# EAGLE design xplorer (EAGLE 6.3)

## Sheet 1 of 5: RPI
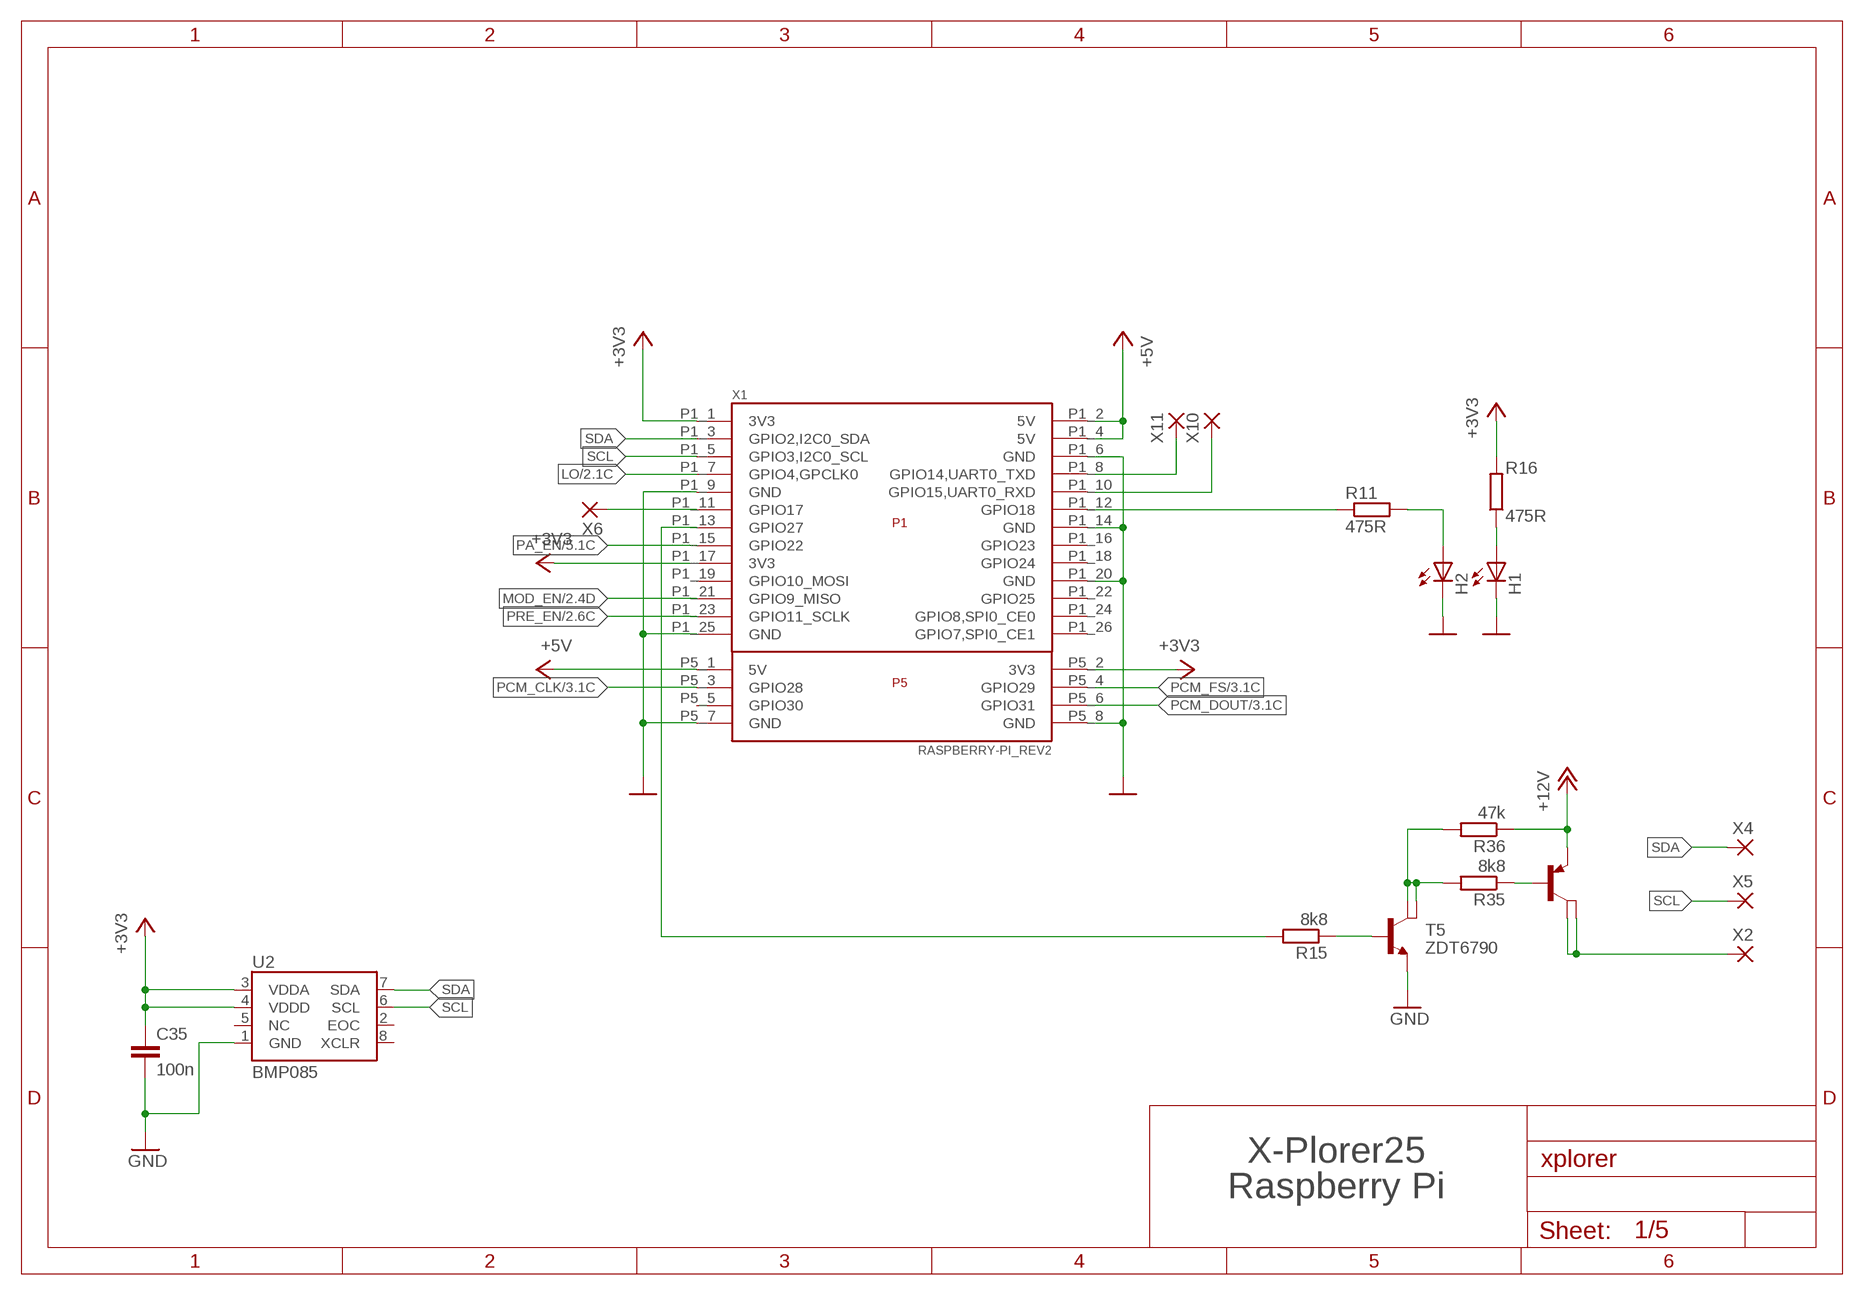
[diagram p0: schematic, sheet 1]

### Parts
C35  100n  C-0603  [0603]
H1  LEDCHIPLED_0603  [CHIPLED_0603]
H2  LEDCHIPLED_0603  [CHIPLED_0603]
R11  475R  R-EU_R0402  [R0402]
R15  8k8  R-EU_R0603  [R0603]
R16  475R  R-EU_R0402  [R0402]
R35  8k8  R-EU_R0603  [R0603]
R36  47k  R-EU_R0603  [R0603]
T5  ZDT6790  [SOT223-8]
U2  BMP085  [BMP085]
X1  RASPBERRY-PI_REV2  [RASPBERRY-PI_REV2]
X2  SMD2  [SMD1,27-2,54]
X4  SMD2  [SMD1,27-2,54]
X5  SMD2  [SMD1,27-2,54]
X6  SMD2  [SMD1,27-2,54]
X10  SMD2  [SMD1,27-2,54]
X11  SMD2  [SMD1,27-2,54]

### Nets
$234567898765: T5.3(C1) T5.4(C2) X2.1(P)
+3V3: C35.1 R16.2 U2.3(VDDA) U2.4(VDDD) X1.P1_1(3V3) X1.P1_17(3V3) X1.P5_2(3V3)
+5V: X1.P1_2(5V) X1.P1_4(5V) X1.P5_1(5V) ; also sheet 2,3,5
+12V: R36.1 T5.5(E) ; also sheet 2,5
GND: C35.2 H1.C H2.C T5.7(E) U2.1(GND) X1.P1_6(GND) X1.P1_9(GND) X1.P1_14(GND) X1.P1_20(GND) X1.P1_25(GND) X1.P5_7(GND) X1.P5_8(GND) ; also sheet 2,3,5
LO: X1.P1_7(GPIO4,GPCLK0) ; also sheet 2
MOD_EN: X1.P1_21(GPIO9_MISO) ; also sheet 2
N$16: H2.A R11.2
N$18: H1.A R16.1
N$29: X1.P1_10(GPIO15,UART0_RXD) X10.1(P)
N$31: R11.1 X1.P1_12(GPIO18)
N$42: R15.1 T5.8(B)
N$54: R35.2 R36.2 T5.1(C1) T5.2(C2)
N$55: R35.1 T5.6(B)
N$57: X1.P1_8(GPIO14,UART0_TXD) X11.1(P)
N$66: R15.2 X1.P1_13(GPIO27)
PA_EN: X1.P1_15(GPIO22) ; also sheet 5
PCM_CLK: X1.P5_3(GPIO28) ; also sheet 3
PCM_DOUT: X1.P5_6(GPIO31) ; also sheet 3
PCM_FS: X1.P5_4(GPIO29) ; also sheet 3
PRE_EN: X1.P1_23(GPIO11_SCLK) ; also sheet 2
REL_FB: X1.P1_11(GPIO17) X6.1(P)
SCL: U2.6(SCL) X1.P1_5(GPIO3,I2C0_SCL) X5.1(P)
SDA: U2.7(SDA) X1.P1_3(GPIO2,I2C0_SDA) X4.1(P)
Unconnected: U2.2(EOC) U2.5(NC) U2.8(XCLR) X1.P1_16(GPIO23) X1.P1_18(GPIO24) X1.P1_19(GPIO10_MOSI) X1.P1_22(GPIO25) X1.P1_24(GPIO8,SPI0_CE0) X1.P1_26(GPIO7,SPI0_CE1) X1.P5_5(GPIO30)

### Notes on the sheet
- T5
- ZDT6790
- X-Plorer25
- Raspberry Pi

## Sheet 2 of 5: IQ
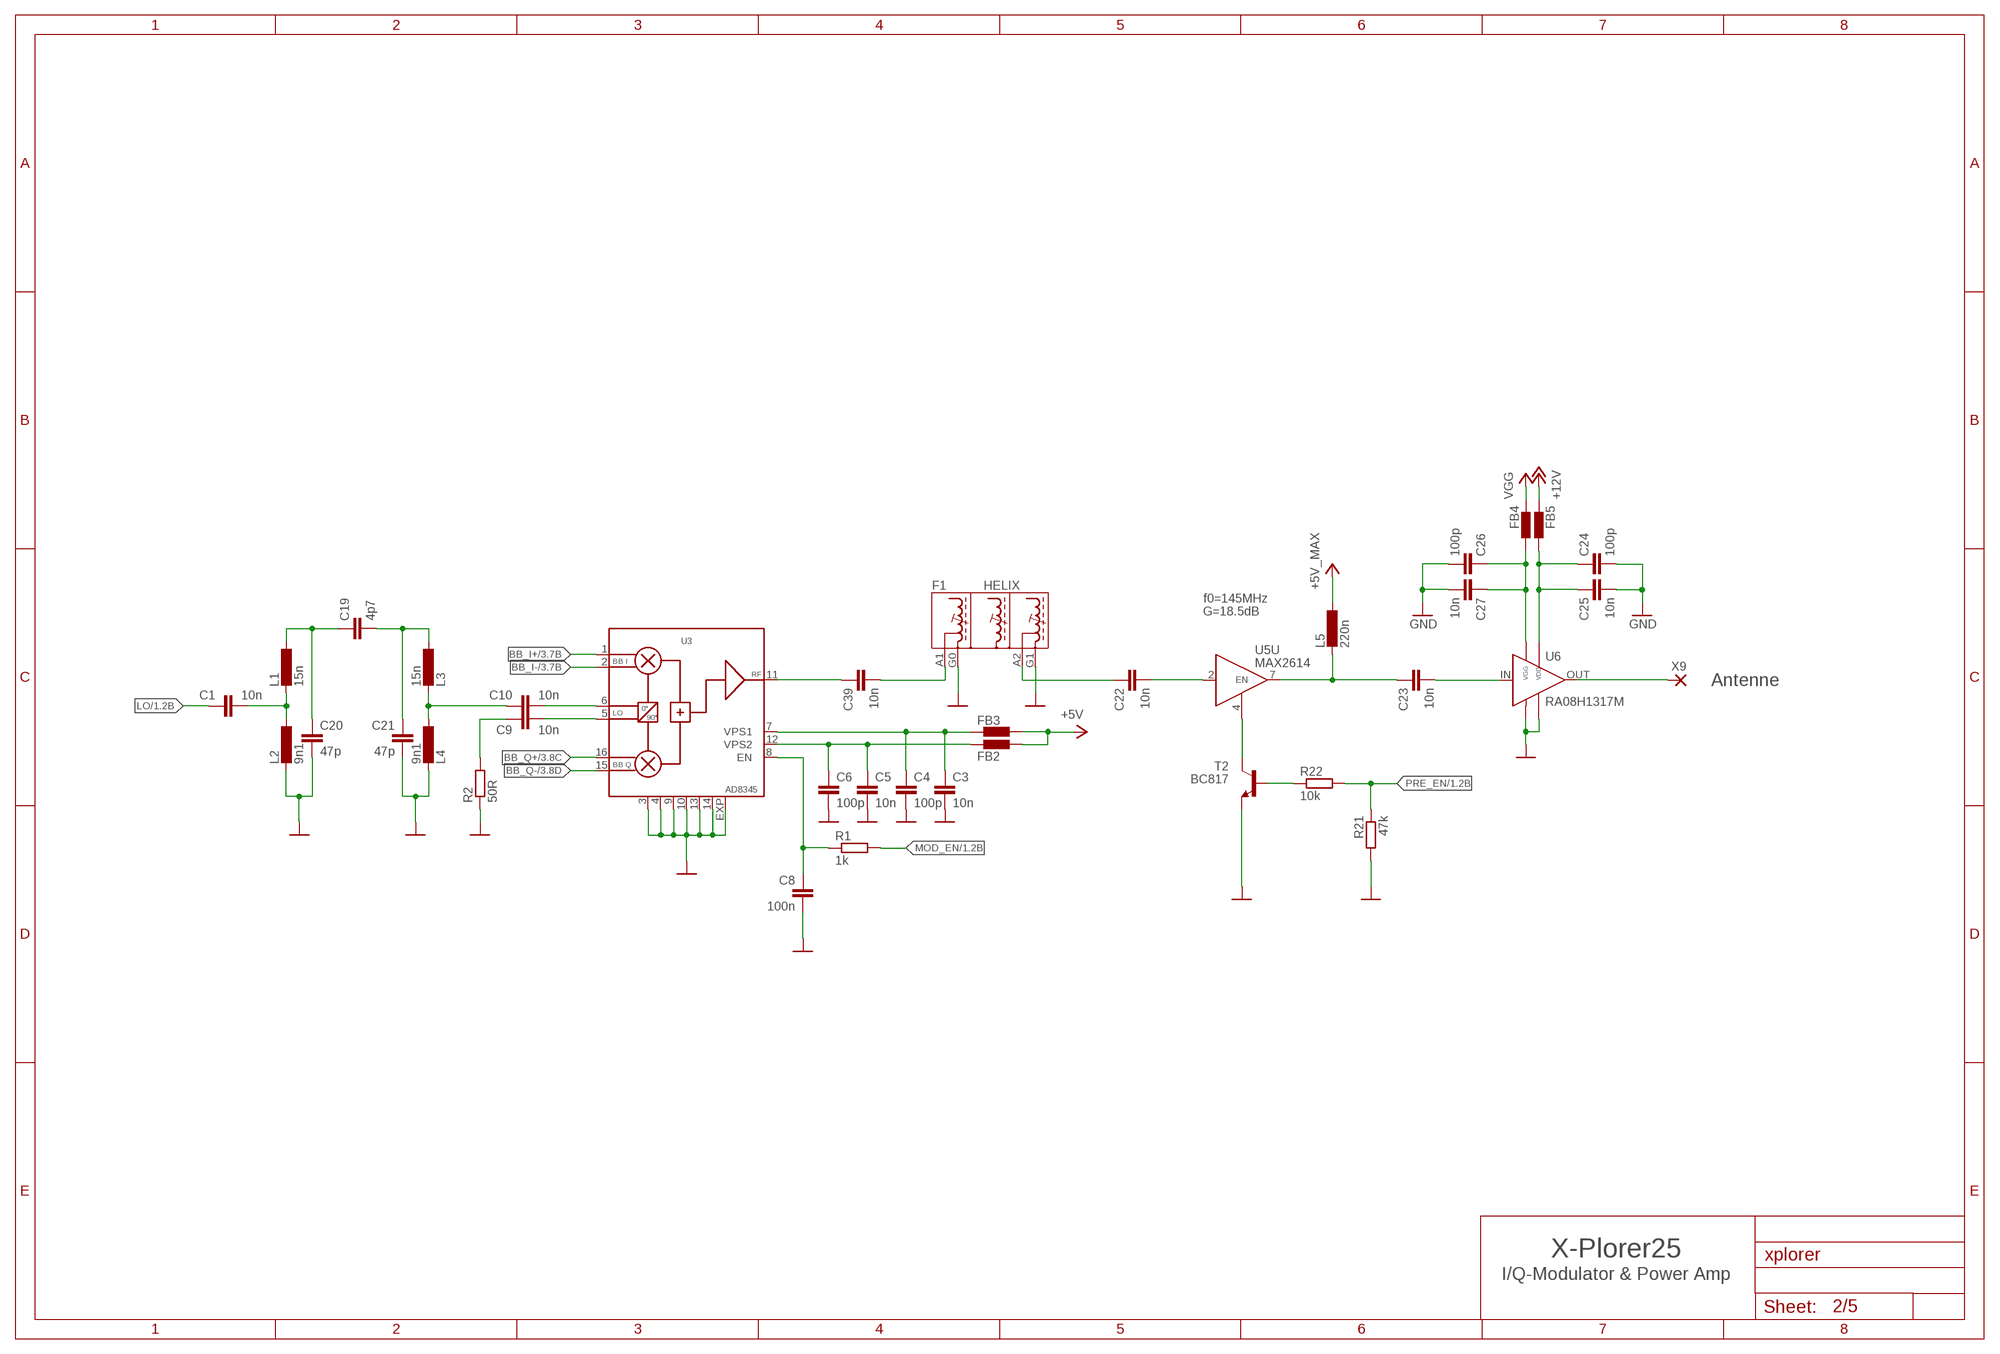
[diagram p1: schematic, sheet 2]

### Parts
C1  10n  C-EUC0603  [C0603]
C3  10n  C-EUC0603  [C0603]
C4  100p  C-EUC0603  [C0603]
C5  10n  C-EUC0603  [C0603]
C6  100p  C-EUC0603  [C0603]
C8  100n  C-EUC0603  [C0603]
C9  10n  C-EUC0603  [C0603]
C10  10n  C-EUC0603  [C0603]
C19  4p7  C-EUC0603  [C0603]
C20  47p  C-EUC1812  [C1812]
C21  47p  C-EUC1812  [C1812]
C22  10n  C-EUC0603  [C0603]
C23  10n  C-EUC0603  [C0603]
C24  100p  C-EUC0603  [C0603]
C25  10n  C-EUC0603  [C0603]
C26  100p  C-EUC0603  [C0603]
C27  10n  C-EUC0603  [C0603]
C39  10n  C-EUC0603  [C0603]
F1  HELIX  [CBT13]
FB2  BML15H  [R0603]
FB3  BML15H  [R0603]
FB4  BML15H  [R0603]
FB5  BML15H  [R0603]
L1  15n  L-EUL2012C  [L2012C]
L2  9n1  L-EUL2012C  [L2012C]
L3  15n  L-EUL2012C  [L2012C]
L4  9n1  L-EUL2012C  [L2012C]
L5  220n  L-EUL2012C  [L2012C]
R1  1k  R-EU_R0603  [R0603]
R2  50R  R-EU_R0603  [R0603]
R21  47k  R-EU_R0603  [R0603]
R22  10k  R-EU_R0603  [R0603]
T2  BC817  BC817-16LT1SMD  [SOT23-BEC]
U3  AD8345  [TSSOP16EXP]
U5  MAX2614  MAX2615  [TDFN8-2X3MM]
U6  RA08H1317M  [RA08H1317M]
X9  SMD2  [SMD1,27-2,54]

### Nets
+5V: FB2.2 FB3.2 ; also sheet 1,3,5
+5V_MAX: L5.1 ; also sheet 5
+12V: FB5.1 ; also sheet 1,5
BB_I+: U3.1(BB_I) ; also sheet 3
BB_I-: U3.2(!BB_I) ; also sheet 3
BB_Q+: U3.16(BB_Q) ; also sheet 3
BB_Q-: U3.15(!BB_Q) ; also sheet 3
CLEAN_LO: C10.1 L3.2 L4.1
GND: C3.2 C4.2 C5.2 C6.2 C8.2 C20.2 C21.2 C24.2 C25.2 C26.2 C27.2 F1.G0(GND) F1.G1(GND) L2.2 L4.2 R2.1 R21.2 T2.E U3.3(GND) U3.4(GND) U3.9(GND) U3.10(GND) U3.13(GND) U3.14(GND) U3.EXP(GND) U6.G1(GND) U6.G2(GND) ; also sheet 1,3,5
LO: C1.1 ; also sheet 1
MOD_EN: R1.2 ; also sheet 1
N$1: C39.2 F1.A1
N$2: C10.2 U3.6(LO)
N$3: C3.1 C4.1 FB3.1 U3.7(VPS1)
N$4: C5.1 C6.1 FB2.1 U3.12(VPS2)
N$5: C8.1 R1.1 U3.8(EN)
N$6: C9.2 U3.5(!LO)
N$7: C9.1 R2.2
N$8: C39.1 U3.11(RF)
N$14: C19.2 C21.1 L3.1
N$15: C22.1 F1.A2
N$17: C1.2 L1.2 L2.1
N$19: C19.1 C20.1 L1.1
N$20: C22.2 U5.2(U:IN)
N$21: C23.1 L5.2 U5.7(U:OUT)
N$22: C23.2 U6.IN
N$23: C24.1 C25.1 FB5.2 U6.VDD
N$24: C26.1 C27.1 FB4.2 U6.VGG
N$26: U6.OUT X9.1(P)
N$40: T2.C U5.4(U:EN)
N$41: R22.1 T2.B
PRE_EN: R21.1 R22.2 ; also sheet 1
VGG: FB4.1 ; also sheet 5

### Notes on the sheet
- f0=145MHz
- G=18.5dB
- Antenne
- X-Plorer25
- I/Q-Modulator & Power Amp

## Sheet 3 of 5: BB
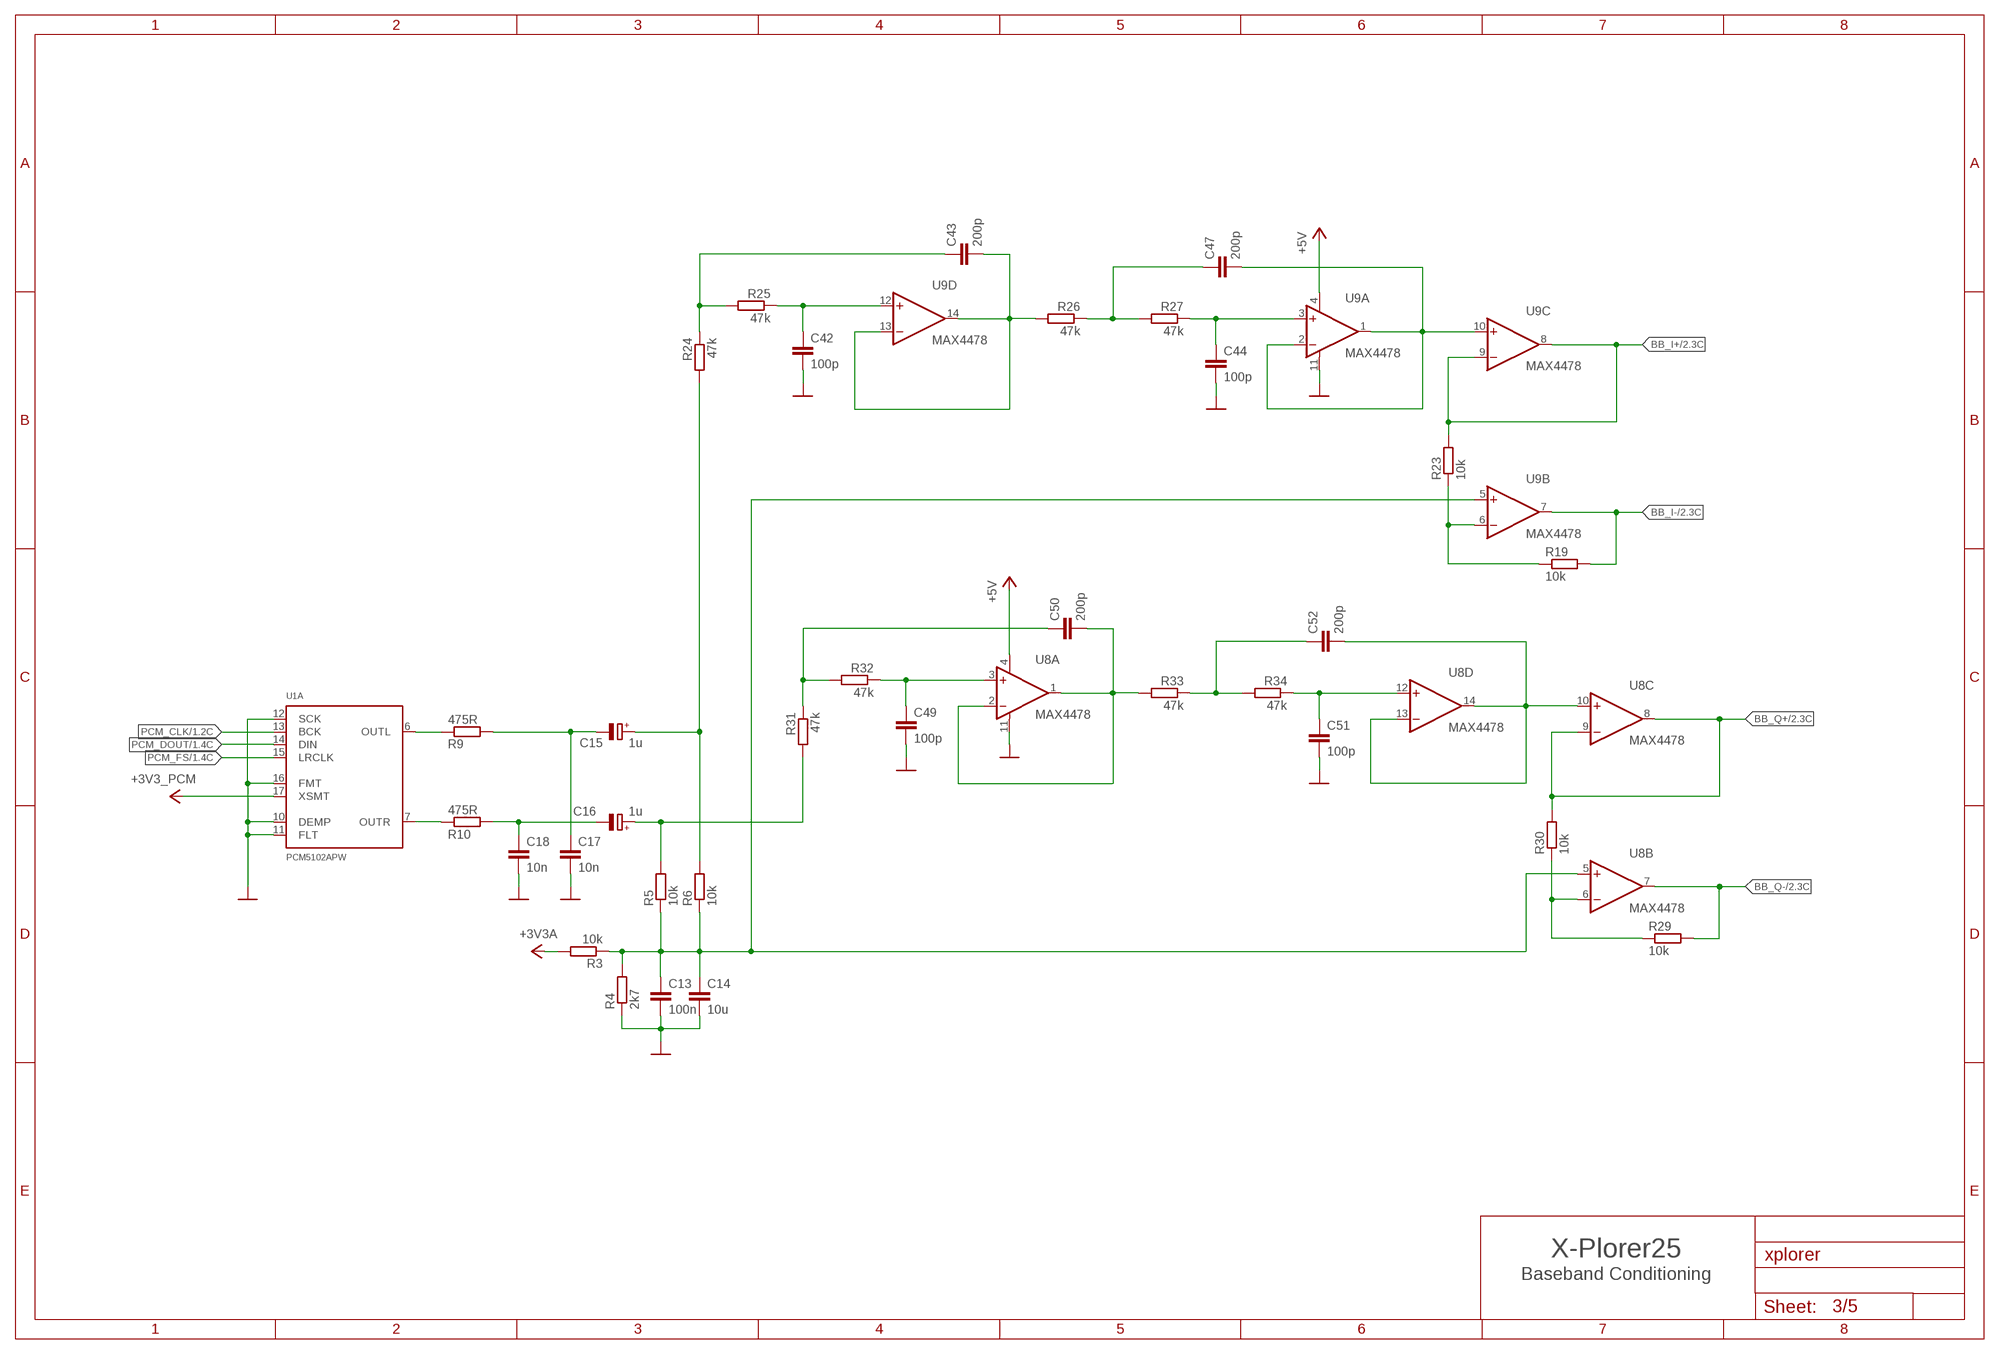
[diagram p2: schematic, sheet 3]

### Parts
C13  100n  C-EUC0603  [C0603]
C14  10u  C-EUC0603  [C0603]
C15  1u  CPOL-EUCT3528  [CT3528]
C16  1u  CPOL-EUCT3528  [CT3528]
C17  10n  C-EUC0603  [C0603]
C18  10n  C-EUC0603  [C0603]
C42  100p  C-EUC0603  [C0603]
C43  200p  C-EUC0805  [C0805]
C44  100p  C-EUC0603  [C0603]
C47  200p  C-EUC0805  [C0805]
C49  100p  C-EUC0603  [C0603]
C50  200p  C-EUC0805  [C0805]
C51  100p  C-EUC0603  [C0603]
C52  200p  C-EUC0805  [C0805]
R3  10k  R-EU_R0603  [R0603]
R4  2k7  R-EU_R0603  [R0603]
R5  10k  R-EU_R0603  [R0603]
R6  10k  R-EU_R0603  [R0603]
R9  475R  R-EU_R0603  [R0603]
R10  475R  R-EU_R0603  [R0603]
R19  10k  R-EU_R0603  [R0603]
R23  10k  R-EU_R0603  [R0603]
R24  47k  R-EU_R0603  [R0603]
R25  47k  R-EU_R0603  [R0603]
R26  47k  R-EU_R0603  [R0603]
R27  47k  R-EU_R0603  [R0603]
R29  10k  R-EU_R0603  [R0603]
R30  10k  R-EU_R0603  [R0603]
R31  47k  R-EU_R0603  [R0603]
R32  47k  R-EU_R0603  [R0603]
R33  47k  R-EU_R0603  [R0603]
R34  47k  R-EU_R0603  [R0603]
U1  PCM5102APW  [PW_R-PDSO-G20]
U8  MAX4478  OPA4132U  [SO14]
U9  MAX4478  OPA4132U  [SO14]

### Nets
$2345: C16.+ R5.2 R31.2
$123456: C15.+ R6.2 R24.2
+3V3_PCM: U1.17(A:XSMT) ; also sheet 5
+3V3A: R3.2 ; also sheet 5
+5V: U8.4(A:V+) U9.4(A:V+) ; also sheet 1,2,5
BB_I+: R23.2 U9.8(C:OUT) U9.9(C:-IN) ; also sheet 2
BB_I-: R19.2 U9.7(B:OUT) ; also sheet 2
BB_Q+: R30.2 U8.8(C:OUT) U8.9(C:-IN) ; also sheet 2
BB_Q-: R29.2 U8.7(B:OUT) ; also sheet 2
GND: C13.2 C14.2 C17.2 C18.2 C42.2 C44.2 C49.2 C51.2 R4.1 U1.10(A:DEMP) U1.11(A:FLT) U1.12(A:SCK) U1.16(A:FMT) U8.11(A:V-) U9.11(A:V-) ; also sheet 1,2,5
N$9: C49.1 R32.1 U8.3(A:+IN)
N$10: R10.1 U1.7(A:OUTR)
N$11: C16.- C18.1 R10.2
N$12: R9.1 U1.6(A:OUTL)
N$32: C50.1 R31.1 R32.2
N$37: C52.2 U8.10(C:+IN) U8.13(D:-IN) U8.14(D:OUT)
N$38: C51.1 R34.1 U8.12(D:+IN)
N$39: C52.1 R33.1 R34.2
N$43: C42.1 R25.1 U9.12(D:+IN)
N$46: C43.1 R24.1 R25.2
N$47: C47.2 U9.1(A:OUT) U9.2(A:-IN) U9.10(C:+IN)
N$48: C44.1 R27.1 U9.3(A:+IN)
N$49: C47.1 R26.1 R27.2
N$50: C43.2 R26.2 U9.13(D:-IN) U9.14(D:OUT)
N$51: C50.2 R33.2 U8.1(A:OUT) U8.2(A:-IN)
N$52: R19.1 R23.1 U9.6(B:-IN)
N$53: R29.1 R30.1 U8.6(B:-IN)
N$64: C15.- C17.1 R9.2
PCM_CLK: U1.13(A:BCK) ; also sheet 1
PCM_DOUT: U1.14(A:DIN) ; also sheet 1
PCM_FS: U1.15(A:LRCLK) ; also sheet 1
VGND: C13.1 C14.1 R3.1 R4.2 R5.1 R6.1 U8.5(B:+IN) U9.5(B:+IN)

### Notes on the sheet
- X-Plorer25
- Baseband Conditioning

## Sheet 4 of 5: Head

## Sheet 5 of 5: PWR
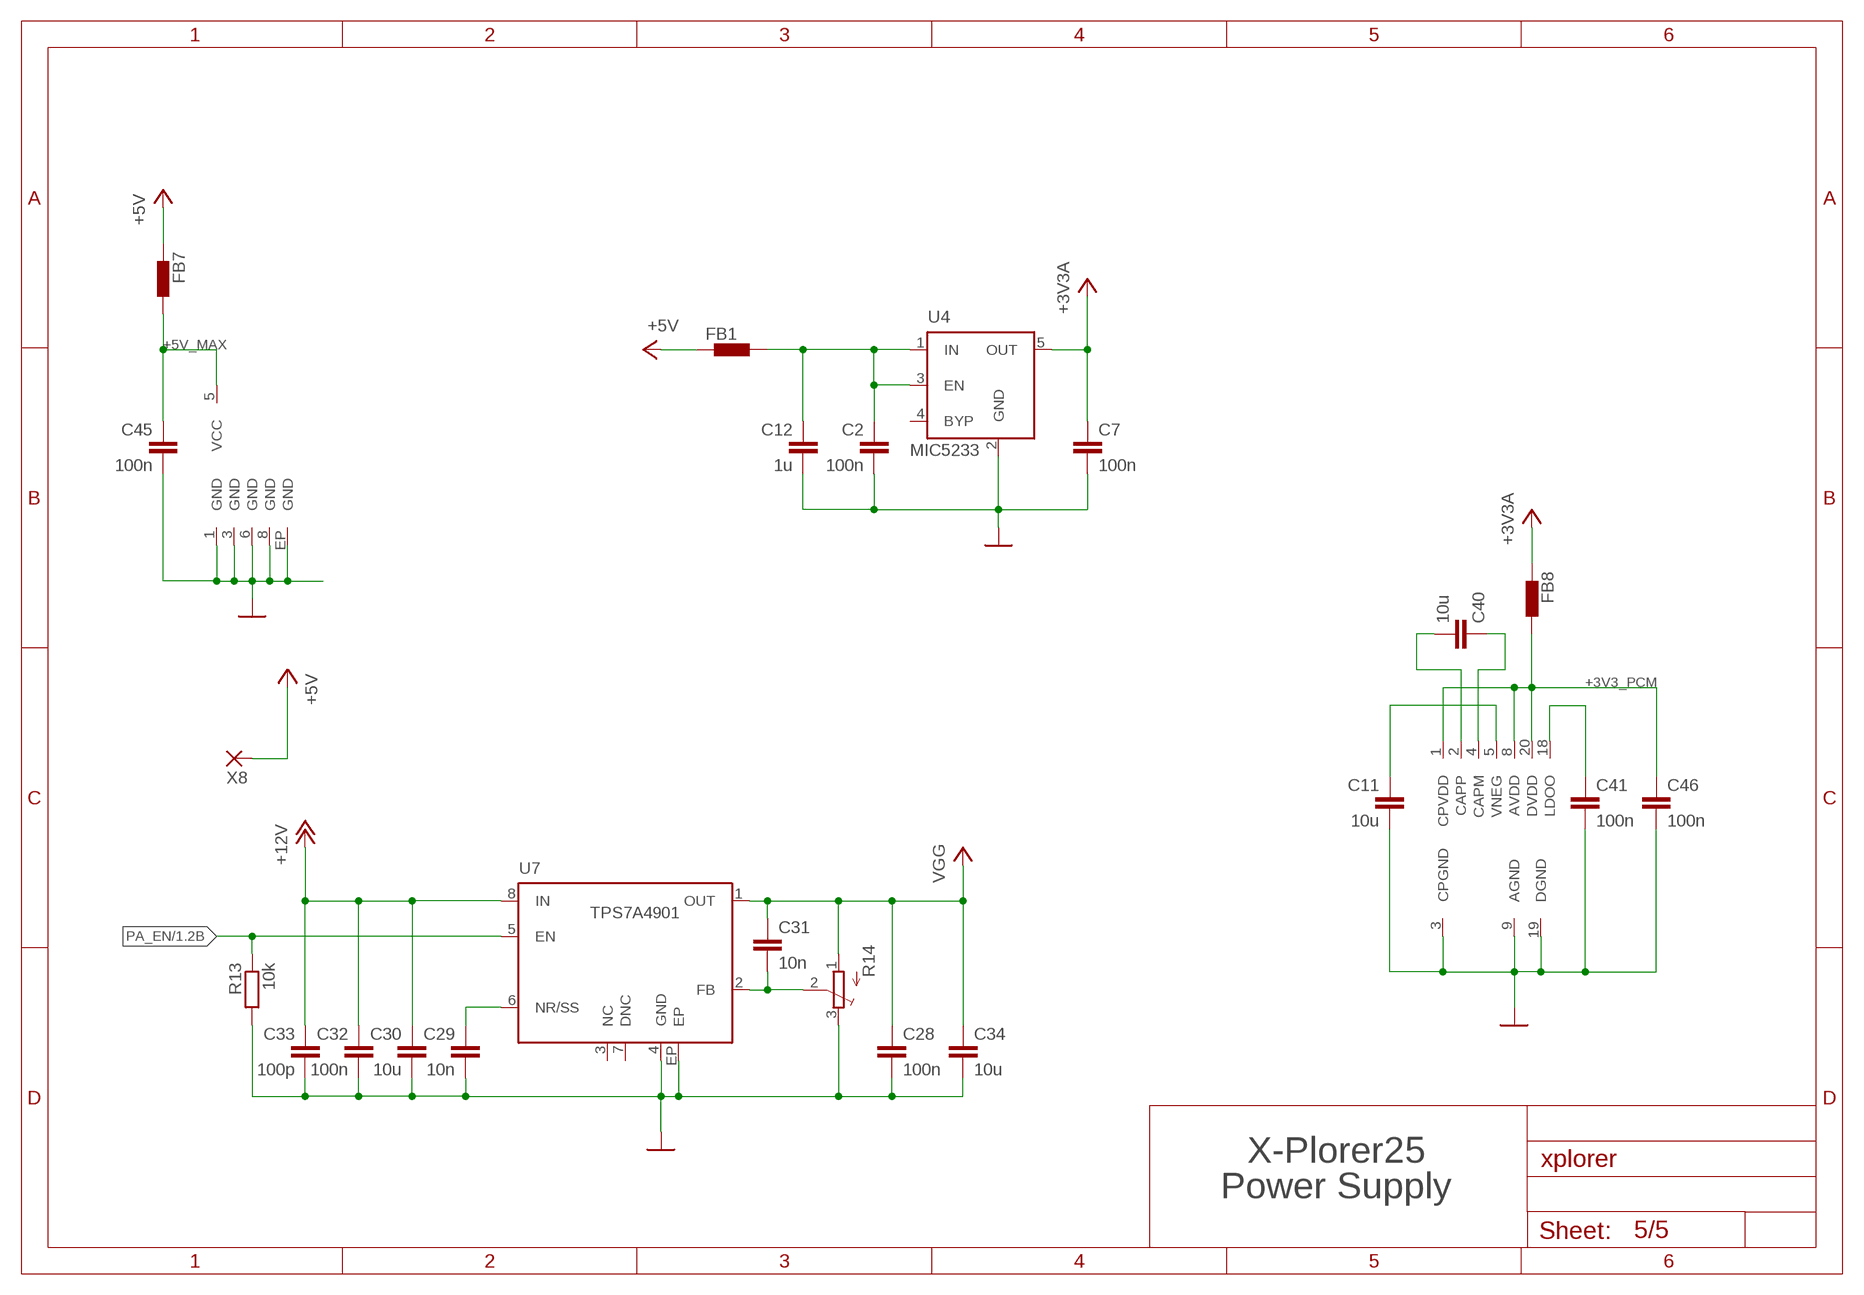
[diagram p3: schematic, sheet 5]

### Parts
C2  100n  C-EUC0603  [C0603]
C7  100n  C-EUC0603  [C0603]
C11  10u  C-EUC0603  [C0603]
C12  1u  C-EUC0603  [C0603]
C28  100n  C-EUC0603  [C0603]
C29  10n  C-EUC0603K  [C0603K]
C30  10u  C-EUC0805  [C0805]
C31  10n  C-EUC0603  [C0603]
C32  100n  C-EUC0603  [C0603]
C33  100p  C-EUC0603  [C0603]
C34  10u  C-EUC0805  [C0805]
C40  10u  C-EUC0603  [C0603]
C41  100n  C-EUC0603  [C0603]
C45  100n  C-EUC0603  [C0603]
C46  100n  C-EUC0603  [C0603]
FB1  BML15H  [R0603]
FB7  BML15H  [R0603]
FB8  BML15H  [R0603]
R13  10k  R-EU_R0603  [R0603]
R14  TRIM_EU-SM-42/43X  [SM-42/43X]
U4  MIC5233  MIC5219XX  [SOT23-5]
U7  TPS7A4901  [PW_R-PDSO-G08]
X8  SMD2  [SMD1,27-2,54]

### Nets
12V_F: C2.1 C12.1 FB1.2 U4.1(IN) U4.3(EN)
+3V3_PCM: C46.1 FB8.2 U1.1(P:CPVDD) U1.8(P:AVDD) U1.20(P:DVDD) ; also sheet 3
+3V3A: C7.1 FB8.1 U4.5(OUT) ; also sheet 3
+5V: FB1.1 FB7.1 X8.1(P) ; also sheet 1,2,3
+5V_MAX: C45.1 FB7.2 U5.5(P:VCC) ; also sheet 2
+12V: C30.1 C32.1 C33.1 U7.8(IN) ; also sheet 1,2
GND: C2.2 C7.2 C11.2 C12.2 C28.2 C29.2 C30.2 C32.2 C33.2 C34.2 C41.2 C45.2 C46.2 R13.2 R14.3(E) U1.3(P:CPGND) U1.9(P:AGND) U1.19(P:DGND) U4.2(GND) U5.1(P:GND) U5.3(P:GND) U5.6(P:GND) U5.8(P:GND) U5.EP(P:GND) U7.4(GND) U7.EP ; also sheet 1,2,3
N$28: C31.2 R14.2(S) U7.2(FB)
N$33: C11.1 U1.5(P:VNEG)
N$34: C40.1 U1.4(P:CAPM)
N$35: C40.2 U1.2(P:CAPP)
N$36: C41.1 U1.18(P:LDOO)
N$44: C29.1 U7.6(NR/SS)
PA_EN: R13.1 U7.5(EN) ; also sheet 1
VGG: C28.1 C31.1 C34.1 R14.1(A) U7.1(OUT) ; also sheet 2
Unconnected: U4.4(BYP) U7.3(NC) U7.7(DNC)

### Notes on the sheet
- X-Plorer25
- Power Supply

## Library data of the parts
C1-C14 C17-C34 C39-C47 C49-C52 = rcl:C-EU: CAPACITOR, European symbol
C15 C16 = rcl:CPOL-EU: POLARIZED CAPACITOR, European symbol
C35 = RC:C
F1 = 272MT-1008A:HELIX
FB1-FB5 FB7 FB8 = FB:BML15H: EMIFIL (R) Chip Ferrite Bead for GHz Noise Source: http://www.murata.com/ Ferrite Bead BLM15H.pdf
H1 H2 = led:LED: LED OSRAM: - CHIPLED LG R971, LG N971, LY N971, LG Q971, LY Q971, LO R971, LY R971 LH N974, LH R974 LS Q976, LO Q976, LY Q976 LO Q996 - Hyper CHIPLED LW Q18S LB Q993, LB Q99A, LB R99A - SideLED LS A670, LO A670, LY A670, LG A670, LP A670 LB A673, LV A673, LT A673, LW A673 LH A674 LY A675 LS A676, LA A676, LO A676, LY A676, LW A676 LS A679, LY A679, LG A679 - Hyper Micro SIDELED® LS Y876, LA Y876, LO Y876, LY Y876 LT Y87S - SmartLED LW L88C, LW L88S LB L89C, LB L89S, LG L890 LS L89K, LO L89K, LY L89K LS L896, LA L896, LO L896, LY L896 - TOPLED LS T670, LO T670, LY T670, LG T670, LP T670 LSG T670, LSP T670, LSY T670, LOP T670, LYG T670 LG T671, LOG T671, LSG T671 LB T673, LV T673, LT T673, LW T673 LH T674 LS T676, LA T676, LO T676, LY T676, LB T676, LH T676, LSB T676, LW T676 LB T67C, LV T67C, LT T67C, LS T67K, LO T67K, LY T67K, LW E67C LS E67B, LA E67B, LO E67B, LY E67B, LB E67C, LV E67C, LT E67C LW T67C LS T679, LY T679, LG T679 LS T770, LO T770, LY T770, LG T770, LP T770 LB T773, LV T773, LT T773, LW T773 LH T774 LS E675, LA E675, LY E675, LS T675 LS T776, LA T776, LO T776, LY T776, LB T776 LHGB T686 LT T68C, LB T68C - Hyper Mini TOPLED® LB M676 - Mini TOPLED Santana® LG M470 LS M47K, LO M47K, LY M47K Source: http://www.osram.convergy.de LUXEON: - LUMILED® LXK2-PW12-R00, LXK2-PW12-S00, LXK2-PW14-U00, LXK2-PW14-V00 LXK2-PM12-R00, LXK2-PM12-S00, LXK2-PM14-U00 LXK2-PE12-Q00, LXK2-PE12-R00, LXK2-PE12-S00, LXK2-PE14-T00, LXK2-PE14-U00 LXK2-PB12-K00, LXK2-PB12-L00, LXK2-PB12-M00, LXK2-PB14-N00, LXK2-PB14-P00, LXK2-PB14-Q00 LXK2-PR12-L00, LXK2-PR12-M00, LXK2-PR14-Q00, LXK2-PR14-R00 LXK2-PD12-Q00, LXK2-PD12-R00, LXK2-PD12-S00 LXK2-PH12-R00, LXK2-PH12-S00 LXK2-PL12-P00, LXK2-PL12-Q00, LXK2-PL12-R00 Source: www.luxeon.com KINGBRIGHT: KA-3528ASYC Source: www.kingbright.com
L1-L5 = rcl:L-EU: INDUCTOR, European symbol
R1-R6 R9-R11 R13 R15 R16 R19 R21-R27 R29-R36 = rcl:R-EU_: RESISTOR, European symbol
R14 = pot:TRIM_EU-: POTENTIOMETER
T2 = transistor-npn:BC817*: NPN Transistor
T5 = ZDT6790:ZDT6790
U1 = PCM5102A:PCM5102A
U2 = SparkFun:BMP085: BMP085 Pressure Sensor Great little MEMS pressure sensor. SKU: COM-09603
U3 = AD8345:AD8345
U4 = v-reg-micrel:MIC5219XX: VOLTAGE REGULATOR; OC_FARNELL: unknown; OC_NEWARK: unknown
U5 = MAX2615:MAX2615
U6 = RA08H1317M:RA08H1317M
U7 = TPS7A4901:TPS7A4901
U8 U9 = burr-brown:OPA4132: High Speed FET-Input Operational Amplifiers; MF: TEXAS INSTRUMENTS; MPN: OPA4132UA; OC_FARNELL: 1212302; OC_NEWARK: 80K6028
X1 = RaspberryPi_v2:RASPBERRY-PI_REV2: Raspberry Pi Board <http://www.raspberrypi.org/> Jacques Lagnel V1.0 (beta) 2012 Mateusz Bawaj V1.1 (beta) 2012 Board dimension: Forum 3D model <http://www.raspberrypi.org/forum/general-discussion/mechanical-profile-3d-models?value=3d%20model&type=1&include=1&search=1&ret=all> The GPIO Connector (P1): http://elinux.org/RPi_Low-level_peripherals The GPIO Connector (P5): http://www.raspberrypi-spy.co.uk/2012/09/raspberry-pi-p5-header/
X2 X4-X6 X8-X11 = wirepad:SMD2: SMD PAD

## Board
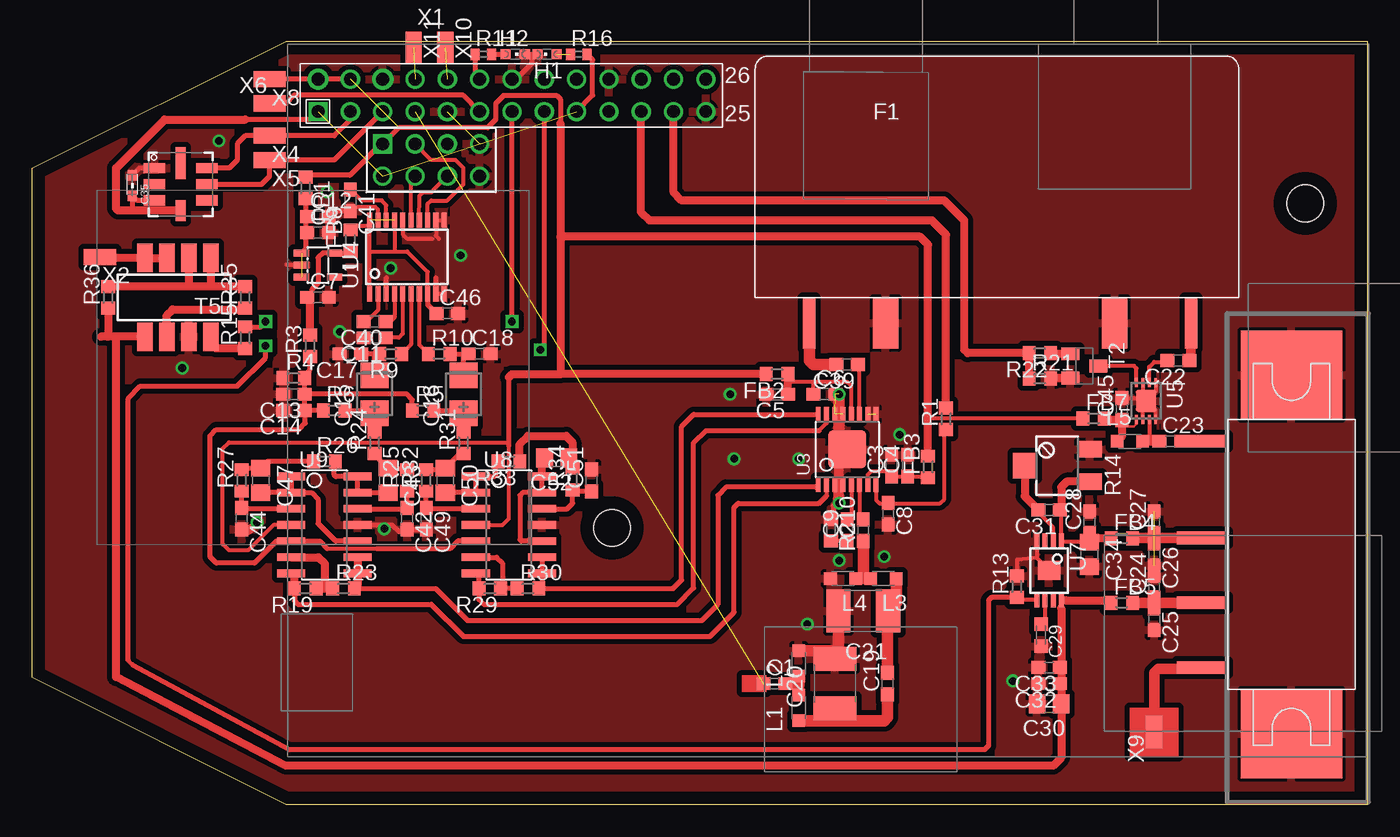
[diagram p4: board, top side]
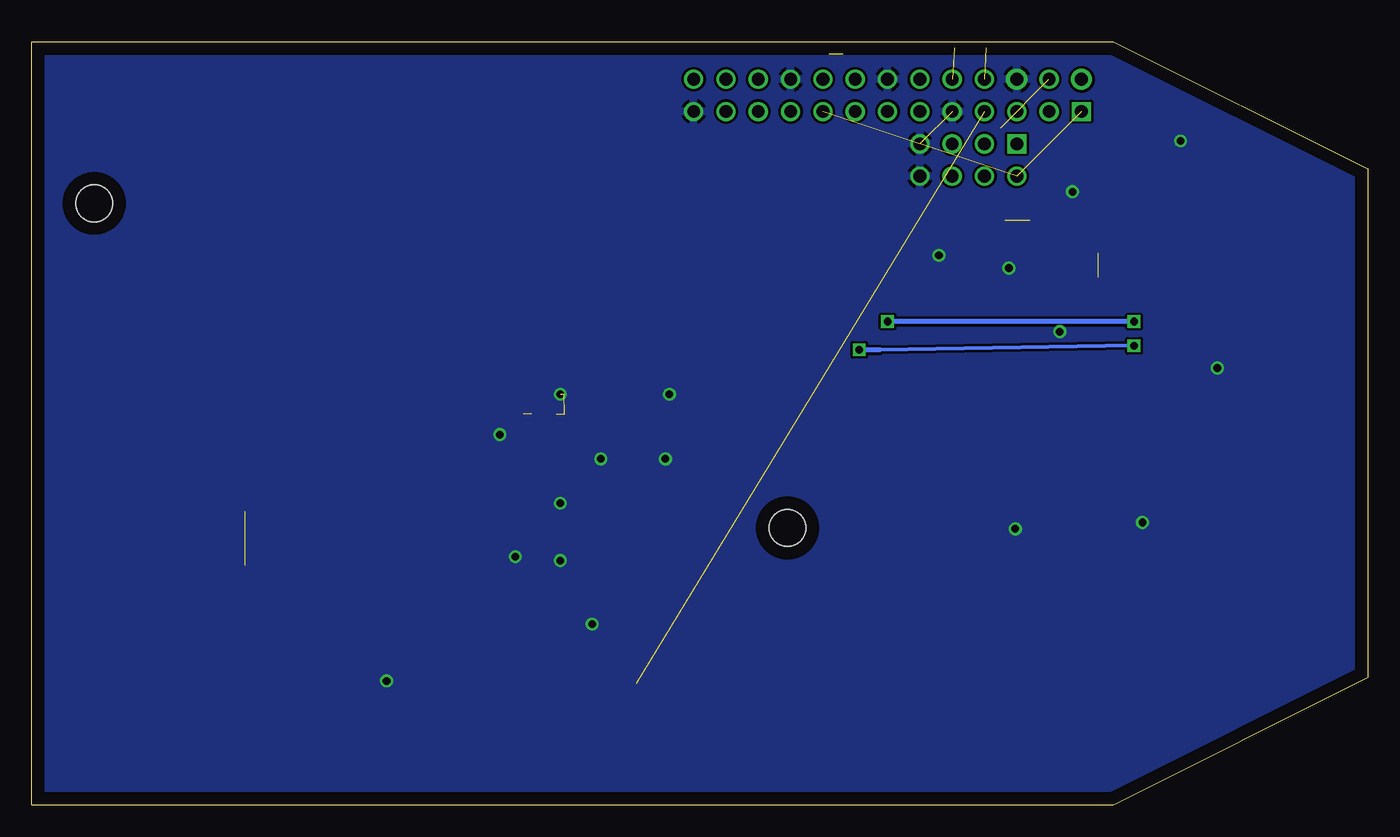
[diagram p5: board, bottom side, seen from below]

Size 105 x 60 mm. Coordinates in mm from the lower left corner, seen from the top.
Outline: 105,0 105,60 20,60 0,50 0,10 20,0 105,0
Copper layers (1*16): Top 0.035mm / dielectric 1.5mm / Bottom 0.035mm
Design rules "default": minimum track width 10mil, minimum drill 24mil, track to track 8mil, track to pad 8mil, pad to pad 8mil, via to via 8mil, smd to smd 8mil, copper to edge 40mil, drill to drill 8mil, minimum pad ring 10mil, minimum via ring 8mil, stop-mask expansion 4mil, vias tented up to drill 0mil, thermal gap 10mil

### Footprints (pad centres in the part's own frame; a part is rotated, then mirrored left to right if it is on the bottom)
C0603 = smd 1.1 x 1: 1 -0.85,0; 2 0.85,0
CT3528 = smd 2 x 2.2: + -1.5,0; - 1.5,0
C1812 = smd 1.9 x 3.4: 1 -1.95,0; 2 1.95,0
C0603K = smd 1.05 x 1.08: 1 -0.875,0; 2 0.875,0
C0805 = smd 1.3 x 1.5: 1 -0.95,0; 2 0.95,0
0603 = smd 0.85 x 0.7: 1 -0.9,0; 2 0.7,0
CBT13 = smd 4 x 1: A1 2,-15; A2 2,15 | smd 4 x 2: G0 2,-9; G1 2,9
R0603 = smd 1 x 1.1: 1 -0.85,0; 2 0.85,0
CHIPLED_0603 = smd 0.8 x 0.8: A 0,-0.75; C 0,0.75
L2012C = smd 1 x 1: 1 -1,0; 2 1,0
R0402 = smd 0.7 x 0.9: 1 -0.65,0; 2 0.65,0
SM-42/43X = smd 1.3 x 1.9: 1 -1.27,-2.55; 3 1.27,-2.55 | smd 2 x 1.9: 2 0,2.55
SOT23-BEC = smd 1 x 1.4: B -0.95,-1.1; C 0,1.1; E 0.95,-1.1
SOT223-8 = smd 1.219 x 2.235: 1 -1.725,-3.099; 2 0,-3.099; 3 1.725,-3.099; 4 3.45,-3.099; 5 3.45,3.099; 6 1.725,3.099; 7 0,3.099; 8 -1.725,3.099
PW_R-PDSO-G20 = smd 0.4 x 1.2: 1 -2.925,-2.9; 2 -2.275,-2.9; 3 -1.625,-2.9; 4 -0.975,-2.9; 5 -0.325,-2.9; 6 0.325,-2.9; 7 0.975,-2.9; 8 1.625,-2.9; 9 2.275,-2.9; 10 2.925,-2.9; 11 2.925,2.9; 12 2.275,2.9; 13 1.625,2.9; 14 0.975,2.9; 15 0.325,2.9; 16 -0.325,2.9; 17 -0.975,2.9; 18 -1.625,2.9; 19 -2.275,2.9; 20 -2.925,2.9
BMP085 = smd 1.67 x 0.8: 1 -2.065,1.27; 2 -2.065,0; 3 -2.065,-1.27; 5 2.065,-1.27; 6 2.065,0; 7 2.065,1.27 | smd 0.8 x 1.67: 4 0,-2.065 | smd 0.8 x 2.5: 8 0,1.65
TSSOP16EXP = smd 0.381 x 1.143: 1 -2.275,-2.768; 2 -1.625,-2.768; 3 -0.975,-2.768; 4 -0.325,-2.768; 5 0.325,-2.768; 6 0.975,-2.768; 7 1.625,-2.768; 8 2.275,-2.768; 9 2.275,2.768; 10 1.625,2.768; 11 0.975,2.768; 12 0.325,2.768; 13 -0.325,2.768; 14 -0.975,2.768; 15 -1.625,2.768; 16 -2.275,2.768 | smd 3 x 3: EXP 0,0
SOT23-5 = smd 0.55 x 1.2: 1 -0.95,-1.3; 2 0,-1.3; 3 0.95,-1.3; 4 0.95,1.3; 5 -0.95,1.3
TDFN8-2X3MM = smd 0.7 x 0.3: 1 -1.45,0.75; 2 -1.45,0.25; 3 -1.45,-0.25; 4 -1.45,-0.75; 5 1.45,-0.75; 6 1.45,-0.25; 7 1.45,0.25; 8 1.45,0.75 | smd 1.74 x 1.63: EP 0,0
RA08H1317M = smd 7 x 8: G1 -14.1,0; G2 14.1,0 | smd 1 x 4: IN -8.9,-7; OUT 8.9,-7; VDD 3.8,-7; VGG -1.3,-7
PW_R-PDSO-G08 = smd 0.4 x 1.2: 1 -0.975,-2.3; 2 -0.325,-2.3; 3 0.325,-2.3; 4 0.975,-2.3; 5 0.975,2.3; 6 0.325,2.3; 7 -0.325,2.3; 8 -0.975,2.3 | smd 1.8 x 1.5: EP 0,0
SO14 = smd 0.61 x 2.21: 1 -3.81,-2.603; 2 -2.54,-2.603; 3 -1.27,-2.603; 4 0,-2.603; 5 1.27,-2.603; 6 2.54,-2.603; 7 3.81,-2.603; 8 3.81,2.603; 9 2.54,2.603; 10 1.27,2.603; 11 0,2.603; 12 -1.27,2.603; 13 -2.54,2.603; 14 -3.81,2.603
RASPBERRY-PI_REV2 = drill 1 square: P1_1 0,0; P5_1 5.08,-2.54 | drill 1 pad 1.676: P1_2 0,2.54; P1_6 5.08,2.54 | drill 1: P1_3 2.54,0; P1_4 2.54,2.54; P1_5 5.08,0; P1_7 7.62,0; P1_8 7.62,2.54; P1_9 10.16,0; P1_10 10.16,2.54; P1_11 12.7,0; P1_12 12.7,2.54; P1_13 15.24,0; P1_14 15.24,2.54; P1_15 17.78,0; P1_16 17.78,2.54; P1_17 20.32,0; P1_18 20.32,2.54; P1_19 22.86,0; P1_20 22.86,2.54; P1_21 25.4,0; P1_22 25.4,2.54; P1_23 27.94,0; P1_24 27.94,2.54; P1_25 30.48,0; P1_26 30.48,2.54; P5_2 5.08,-5.08; P5_3 7.62,-2.54; P5_4 7.62,-5.08; P5_5 10.16,-2.54; P5_6 10.16,-5.08; P5_7 12.7,-2.54; P5_8 12.7,-5.08 | hole 2.9: 77.6,-7.225; 23.1,-32.725
SMD1,27-2,54 = smd 1.27 x 2.54: 1 0,0

### Placement (x,y rotation side)
C1  58.37,9.52 0 top
C2  22.5,44.98 0 top
C3  67.58,26.67 90 top
C4  68.85,26.67 90 top
C5  58.59,32.27 180 top
C6  62.3,32.28 0 top
C7  22.5,39.89 0 top
C8  67.31,22.88 270 top
C9  64.09,21.59 90 top
C10  65.35,21.59 90 top
C11  26.95,36.72 180 top
C12  22.5,46.24 0 top
C13  20.59,32.27 180 top
C14  20.59,31 180 top
C15  26.95,32.27 90 top
C16  33.93,32.27 90 top
C17  25.04,35.45 180 top
C18  35.2,35.45 0 top
C19  67.26,9.52 90 top
C20  63.13,9.52 90 top
C21  65.35,15.24 180 top
C22  90.12,34.92 180 top
C23  89.48,28.57 0 top
C24  88.22,17.15 90 top
C25  88.22,14.6 270 top
C26  88.22,19.69 270 top
C27  88.22,22.23 90 top
C28  83.13,22.23 90 top
C29  79.33,13.34 270 top
C30  79.96,7.94 180 top
C31  79.96,23.18 180 top
C32  79.96,9.52 180 top
C33  79.96,10.8 180 top
C34  83.13,19.69 270 top
C35  7.89,48.78 90 top
C39  64.09,34.61 180 top
C40  26.95,37.99 180 top
C41  25.04,47.52 270 top
C42  29.5,22.5 270 top
C43  28,25.5 270 top
C44  16.5,22.5 270 top
C45  85.67,31.11 90 top
C46  32.66,38.62 0 top
C47  18,25.5 270 top
C49  31,22.5 270 top
C50  32.5,25.5 270 top
C51  44,25.5 90 top
C52  41.25,27.25 180 top
F1  76.11,39.87 270 top
FB1  21.52,48.5 270 top
FB2  58.59,33.86 180 top
FB3  70.44,26.56 90 top
FB4  85.67,20.95 0 top
FB5  85.67,15.88 0 top
FB7  83.46,30.37 0 top
FB8  25.04,44.34 90 top
H1  40.5,59 90 top
H2  38,59 270 top
L1  60.27,7.62 90 top
L2  60.27,11.11 90 top
L3  66.94,17.78 180 top
L4  63.77,17.78 180 top
L5  86.31,28.57 0 top
R1  71.86,30.35 90 top
R2  62.81,21.59 270 top
R3  21.86,36.09 90 top
R4  20.59,33.55 0 top
R5  30.76,31 0 top
R6  23.77,31 0 top
R9  28.21,35.45 180 top
R10  32.02,35.45 0 top
R11  35.5,59 0 top
R13  77.42,17.15 90 top
R14  80.59,26.67 90 top
R15  16.79,36.72 90 top
R16  43,59 0 top
R19  21.5,17 180 top
R21  79.23,33.5 0 top
R22  79.23,35.5 180 top
R23  24.5,17 0 top
R24  26.95,28.46 90 top
R25  29.5,25.5 90 top
R26  23,27 0 top
R27  16.5,25.5 90 top
R29  36,17 180 top
R30  39,17 0 top
R31  33.93,28.46 90 top
R32  31,25.5 90 top
R33  37.5,27 180 top
R34  42.5,25.61 90 top
R35  16.79,39.89 90 top
R36  5.99,39.89 90 top
T2  82.73,34.5 270 top
T5  12.34,39.89 180 top
U1  29.48,43.07 0 top
U2  11.71,48.78 0 top
U3  64.09,27.94 0 top
U4  22.5,42.44 270 top
U5  87.58,31.75 270 top
U6  99.01,19.69 270 top
U7  79.96,18.41 180 top
U8  37.5,22 270 top
U9  23,22 270 top
X1  22.5,54.5 0 top
X2  5.36,43.07 90 top
X4  18.69,52.59 90 top
X5  18.69,50.69 90 top
X6  18.69,55.13 270 top
X8  18.69,57.04 90 top
X9  88.22,5.72 0 top
X10  32.5,59.5 180 top
X11  30,59.5 180 top

### Tracks (layer width: path | path; a pad name or v marks a point on that pad's centre or on a via)
12V_F  (1 unrouted)
  Top 0.406: FB1.2 21.52,46.5 | 21.52,46.5 21.52,44.5 | 21.52,44.5 21.52,43.7 U4.1 | C2.1 21.65,44.63 21.52,44.5 | C12.1 21.65,46.37 21.52,46.5
$2345
  Top 0.406: R5.2 33.52,31 C16.+ R31.2
$123456
  Top 0.406: R6.2 26.71,31 C15.+ R24.2
$234567898765
  Top 0.61: X2.1 5.43,42.99 T5.4 T5.3
+3V3  (2 unrouted)
  Top 0.406: X1.P1_1 21.86,53.87 16.79,53.87 | U2.3 8.27,47.52 C35.1 7.89,46.83 8,46.72 | X1.P1_17 44.09,55.77 44.09,58.56 R16.2
  Top 0.61: U2.4 8,46.72 6.79,46.72 6.62,46.88 6.62,50.05 10.44,53.87 16.79,53.87
+3V3_PCM  (1 unrouted)
  Top 0.305: U1.17 28.51,43.51 28.5,43.5 | U1.8 31.11,41.89 29.5,43.5 28.5,43.5 | U1.1 U1.20 26.56,45.56 26.5,45.5 25.35,45.5 FB8.2 | 26.5,43.5 28.5,43.5
  Top 0.406: U1.8 31.11,39.33 C46.1
+3V3A
  Top 0.406: FB8.1 24.93,43.38 U4.5 22.89,43.38 22.5,43 22.5,41 22,40.5 22,40.24 C7.1
  Top 0.61: R3.2 21.86,39.68 C7.1
+5V  (1 unrouted)
  Top 0.305: U8.4 37,22 37.5,22.5 37.5,28.23 | U9.4 19,22 17,20 15.5,20 15,20.5 15,28 15.5,28.5 37.5,28.5 | FB7.1 70.44,30.37
  Top 0.406: X1.P1_4 X1.P1_2 X8.1 | FB1.1 21.66,49.5 25,49.5 27.46,51.96 X1.P5_1 28.85,53.23 35.84,53.23 36.47,53.87 36.47,55.13 37.11,55.77 41.23,55.77 41.55,55.45 41.55,53.55 | 37.5,28.23 37.5,28.5 37.5,33.62 | 41.56,33.86 41.55,33.86
  Top 0.61: FB3.2 70.44,30.37 70.44,44.02 69.81,44.66 41.55,44.66 | 41.55,53.55 41.55,44.66 | 41.55,44.66 41.55,33.86 37.74,33.86 37.5,33.62 | FB2.2 41.56,33.86
+5V_MAX
  Top 0.203: U5.5 86.83,29.93 86.64,29.73 85.68,29.73 85.68,30.26 C45.1
  Top 0.61: FB7.2 84.41,30.27 C45.1 85.67,28.94 L5.1
+12V
  Top 0.305: 80.92,15.45 80.94,15.46 U7.8 81.2,16.12 81.24,16.08
  Top 0.61: 80.92,15.45 80.92,11 | 80.92,11 80.92,9.1 | 80.92,9.1 C30.1 | C30.1 | C32.1 80.81,9.21 80.92,9.1 | C33.1 80.81,10.89 80.92,11 | 81.24,16.08 84.62,16.08 FB5.1 | T5.5 6.62,36.8 | 6.62,36.8 5.99,36.8 | 5.99,36.8 5.43,36.8 | R36.1 5.99,36.8 | C30.1 80.92,3.7 80.28,3.06 19.96,3.06 6.62,10.05 6.62,36.8
BB_I+
  Top 0.305: U3.1 61.61,24.97
  Top 0.406: R23.2 31.74,17 34.25,14.49 52.66,14.49 53.93,15.77 53.93,24.34 54.57,24.97 61.61,24.97
  Top 0.61: U9.9 U9.8 25.6,17.25 R23.2
BB_I-
  Top 0.305: U3.2 62.46,24.29
  Top 0.406: R19.2 20.65,16.03 20.91,15.77 31.39,15.77 33.93,13.23 53.3,13.23 55.2,15.13 55.2,23.39 55.52,23.7 61.87,23.7 62.46,24.29
  Top 0.61: R19.2 20.65,17.94 U9.7
BB_Q+
  Top 0.305: 52.05,30.71 52.03,30.69 | U3.16 61.57,30.71 61.55,30.69
  Top 0.406: U3.16 61.79,30.69 52.03,30.69 51.08,29.73 51.08,17.67 50.41,17 R30.2 40.1,17.25 U8.8 U8.9
BB_Q-
  Top 0.305: U3.15 62.46,30.01 61.87,29.42
  Top 0.406: 61.87,29.42 52.98,29.42 52.03,28.46 52.03,17.03 50.76,15.77 35.52,15.77 35.15,16.13 R29.2 35.15,17.94 U8.7
CLEAN_LO
  Top 0.889: L4.1 65.36,17.78 | 65.36,17.78 L3.2 | C10.1 65.35,17.79 65.36,17.78
GND  (via drill 0.6)  (6 unrouted)
  Top 0.305: U5.3 87.33,32.27 | 87.33,32.27 87.33,32 U5.EP | U5.1 88.33,32.5 U5.EP | C45.2 87.02,31.96 87.33,32.27 | U5.6 87.33,31.5 U5.EP | U5.8 88.33,31 U5.EP | U7.4 78.98,19.39 | 78.98,19.39 U7.EP | U1.19 27.21,46.79 27,47 25.38,47 C41.2 | U1.16 29.16,44.84 29.5,44.5 31.5,44.5 | U1.11 U1.12 31.76,44.74 32,44.5 | U1.10 U1.9 | U3.4 U3.3 63.11,24.05 v63.46,23.7 | U4.2 20.07,42.44 20,42.5 | 78.98,19.39 77.43,19.26 R13.2
  Top 0.406: U1.3 27.86,41.45 | U1.9 31.76,41.43 | U9.11 28.33,22 28.85,21.48 29.33,21.48 C42.2 C49.2 | U2.1 8.46,50.05 C35.2 | v63.46,23.7 63.2,23.7 63,23.5 63,22.5 62.5,22.5 | C41.2 23.77,46.66 C12.2 | H2.C H1.C 39.7,58.95 39.33,58.95 39.33,58.31 38.06,57.04 X1.P1_14
  Top 0.61: T2.E 80.13,33.55 R21.2 | v17.7,22.2 17,21.5 16.65,21.5 C44.2
  Top 0.762: U3.EXP 64.09,27.5 63.46,26.88 v63.46,23.7
  Top 0.889: L2.2 62.98,12.11 63.14,11.95 C20.2 63.41,11.75 C21.2 | U3.EXP 64.09,28.47 63.46,29.1 v63.46,32.27
  other vias: 60.28,27.2 55.2,27.2 68.22,29.1 67,19.5 27.7,21.7 14.7,52.2 28.2,42.2 33.7,43.2 24.2,37.2 63.46,19.2 60.96,14.2 23.2,48.2 11.82,34.34 77.11,9.73 54.88,32.27
  pour Bottom: 0,50 20,60 105,60 105,0 20,0 0,10
  pour Top (isolate 0.406): 0,50 20,60 105,60 105,0 20,0 0,10
LO  (1 unrouted)
MOD_EN
  Top 0.61: R1.2 71.86,44.83 70.76,45.93 48.53,45.93 47.9,46.56 X1.P1_21
N$1
  Top 0.889: C39.2 61.44,34.61 61.11,34.94 F1.A1
N$2
  Top 0.305: U3.6 65.06,22.73 C10.2
N$3
  Top 0.305: FB3.1 70.44,25.82 C4.1 C3.1 67.05,26.24 66,26.24 65.71,25.95 U3.7
N$4
  Top 0.305: U3.12 64.41,32.91 64.09,33.23 61.55,33.23 | 61.55,33.23 59.33,33.23 59.33,33.75 FB2.1 | C6.1 61.45,33.12 61.55,33.23
  Top 0.61: C5.1 FB2.1
N$5
  Top 0.305: U3.8 66.36,23.98 66.63,23.7 67.27,23.7 | C8.1 67.27,23.7 | 67.27,23.7 71.4,23.7 71.71,24.02 71.71,29.35 R1.1
N$6
  Top 0.305: U3.5 64.41,22.77 C9.2
N$7
  Top 0.305: C9.1 R2.2
N$8
  Top 0.305: U3.11 65.06,34.48 C39.1
N$9
  Top 0.406: R32.1 C49.1 31.08,23.27 U8.3
N$10
  Top 0.305: U1.7 30.46,36.16 R10.1
N$11
  Top 0.406: R10.2 33.93,35.45 | C16.- 33.93,35.45 | 33.93,35.45 C18.1
N$12
  Top 0.305: U1.6 29.81,36.2 R9.1
N$14
  Top 0.889: C19.2 67.26,15.2 C21.1 67.94,15.88 L3.1
N$15
  Top 0.762: F1.A2 91.11,35.06 C22.1
N$16
  Top 0.406: R11.2 H2.A
N$17
  Top 0.889: C1.2 60.17,9.52 60.28,9.41 | 60.28,9.41 60.28,10.1 L2.1 | L1.2 60.27,9.41 60.28,9.41
N$18  (1 unrouted)
N$19
  Top 0.889: L1.1 63.14,6.62 | 63.14,6.62 67.01,6.62 67.27,6.88 C19.1 | C20.1 63.13,6.63 63.14,6.62
N$20
  Top 0.305: U5.2 87.83,34.42 88.22,34.81 89.16,34.81 C22.2
N$21
  Top 0.305: U5.7 87.83,28.86 87.91,28.78
  Top 0.61: L5.2 87.91,28.57 | 87.91,28.57 C23.1 | 87.83,28.86 87.83,28.65 87.91,28.57
N$22
  Top 0.61: U6.IN 90.34,28.59 C23.2
N$23
  Top 0.813: U6.VDD 87.91,15.88 | 87.91,15.88 86.53,15.88 FB5.2 | C25.1 C24.1 88.22,16.2 87.91,15.88
N$24
  Top 0.813: U6.VGG 88.22,20.98 | 88.22,20.98 86.56,20.98 FB4.2 | 88.22,20.98 88.22,21.48 88.22,21.47 C27.1 88.22,20.99 88.22,20.98 | 88.22,20.98 C26.1
N$26
  Top 0.813: X9.1 88.22,10.36 88.54,10.69 91.91,10.69 U6.OUT
N$28
  Top 0.305: U7.2 80.28,21.8 79.11,22.97 C31.2
  Top 0.61: R14.2 78.05,24.24 C31.2
N$29  (1 unrouted)
N$31
  Top 0.406: R11.1 34.85,57.39 X1.P1_12
N$32
  Top 0.406: R32.2 32.4,26.35 C50.1 33.66,27.61 R31.1
N$33
  Top 0.305: U1.5 29.16,37.03 28.85,36.72 C11.1
N$34
  Top 0.305: U1.4 28.51,38.28 28.21,37.99 C40.1
N$35
  Top 0.305: U1.2 27.21,38.89 26.31,37.99 C40.2
N$36
  Top 0.305: U1.18 27.86,47.14 27.5,47.5 25.91,47.5 C41.1
N$37
  Top 0.406: U8.14 U8.13 38.58,24.54 38.38,24.34 38.38,20.84 38.49,20.73 U8.10
  Top 0.61: U8.14 40.1,27.05 C52.2
N$38
  Top 0.406: U8.12 42.07,23.27 42.5,23.7 R34.1 42.61,24.65 C51.1
N$39
  Top 0.61: R33.1 38.35,28.35 39,29 42,29 42.5,28.5 R34.2 42.5,26.95 C52.1
N$40
  Top 0.305: U5.4 86.83,34.3 86.64,34.5 T2.C
N$41
  Top 0.61: T2.B 80.13,35.45 R22.1
N$42
  Top 0.61: R15.1 14.46,35.87 14.24,36.09 14.24,36.62 T5.8
N$43
  Top 0.406: U9.12 29.42,23.27 C42.1 R25.1
N$44
  Top 0.305: U7.6 79.63,14.52 C29.1
N$46
  Top 0.406: R24.1 27.3,27.15 C43.1 29.4,26.45 R25.2
N$47
  Top 0.406: U9.2 C47.2 | U9.1 U9.2 | U9.10 23.89,20.73 22.5,22.12 22.5,24.02 21.98,24.54 U9.2
N$48
  Top 0.406: R27.1 C44.1 16.58,23.27 U9.3
N$49
  Top 0.406: R27.2 16.6,26.45 C47.1 18.55,27 R26.1
N$50
  Top 0.406: R26.2 23.77,26.92 23.77,25.93 23.89,25.81 U9.14 U9.13 C43.2
N$51
  Top 0.406: C50.2 32.39,24.66 32.02,24.66 32.14,24.54 U8.2 U8.1 36.36,25.81 36.47,25.93 36.47,26.82 R33.2
N$52
  Top 0.61: U9.6 22.54,19.46 23,19 23,17 | 23,17 R19.1 | R23.1 23,17
N$53
  Top 0.406: U8.6 36.54,19.46 37,19 37,17.15 R29.1 R30.1
N$54
  Top 0.61: R35.2 13.93,40.74 | 13.93,40.74 12.34,40.74 | 12.34,40.74 R36.2 | T5.2 12.34,40.74 | T5.1 14.06,40.88 13.93,40.74
N$55
  Top 0.61: T5.6 10.62,38.49 11.07,38.94 16.68,38.94 R35.1
N$57  (1 unrouted)
N$64
  Top 0.406: 26.95,35.45 C17.1 | C15.- 26.95,35.45 | 26.95,35.45 R9.2
N$66  (via drill 0.6)
  Top 0.305: 37.74,53.87 X1.P1_13
  Top 0.406: v37.74,37.99 37.74,53.87 | R15.2 17.95,37.57 v18.37,37.99
  Bottom 0.406: v18.37,37.99 v37.74,37.99
PA_EN  (via drill 0.6)
  Top 0.305: U7.5 77.6,16.12 R13.1 | 7.89,11 7.58,11.32
  Top 0.406: R13.1 75.42,16.3 75.2,16.08 75.2,4.65 74.89,4.34 20.28,4.34 7.89,11 | 7.58,11.32 7.58,31.96 8.53,32.91 16.15,32.91 18.37,35.13 v18.37,36.09 | X1.P1_15 40.28,36.09 v39.96,35.77
  Bottom 0.305: v18.37,36.09 38.38,35.77
  Bottom 0.406: 38.38,35.77 v39.96,35.77
PCM_CLK
  Top 0.305: U1.13 31.12,47.25 31.39,47.52 32.66,47.52 33.93,48.78 33.93,50.05 33.3,50.69 31.39,50.69 X1.P5_3
PCM_DOUT
  Top 0.305: U1.14 30.48,47.87 30.76,48.15 31.39,48.15 X1.P5_6
PCM_FS
  Top 0.305: U1.15 29.82,49.12 X1.P5_4
PRE_EN
  Top 0.61: R21.1 R22.2 73.57,35.5 73.3,35.77 73.3,45.93 71.71,47.52 51.08,47.52 50.44,48.15 X1.P1_23
REL_FB
  Top 0.406: X1.P1_11 33.93,55.77 20.59,55.77 19.96,55.13 X6.1
SCL
  Top 0.406: X1.P1_5 23.77,50.69 X5.1 18.69,49.42 18.05,48.78 U2.6
SDA
  Top 0.406: X1.P1_3 25.04,53.87 23.77,52.59 X4.1 16.79,52.59 16.15,51.96 16.15,50.69 15.52,50.05 U2.7
VGG
  Top 0.305: C34.1 83.06,20.72 U7.1 80.94,22.73 C31.1
  Top 0.61: R14.1 81.35,25.4 80.92,24.97 80.92,22.97 C31.1 | FB4.1 83.56,20.95 | 83.56,20.95 C28.1 | 83.56,20.95 C34.1
VGND
  Top 0.305: 27.12,20.12 23.25,20.12
  Top 0.406: R5.1 29.91,31.86 29.48,32.27 C13.1 | R6.1 C14.1 | C14.1 C13.1 | C13.1 R4.2 21.45,33.76 21.86,34.18 R3.1 | U8.5 33.48,20.73 32.88,20.12 27.12,20.12 | 23.25,20.12 22.64,20.73 U9.5 19.23,20.73 17.5,19 14.5,19 14,19.5 14,29 14.5,29.5 21,29.5 21.5,30 21.5,30.95 C14.1
(copper drawn outside any net)
  shapes: Top area x2